# EAGLE design led_clusters (EAGLE 5.10)
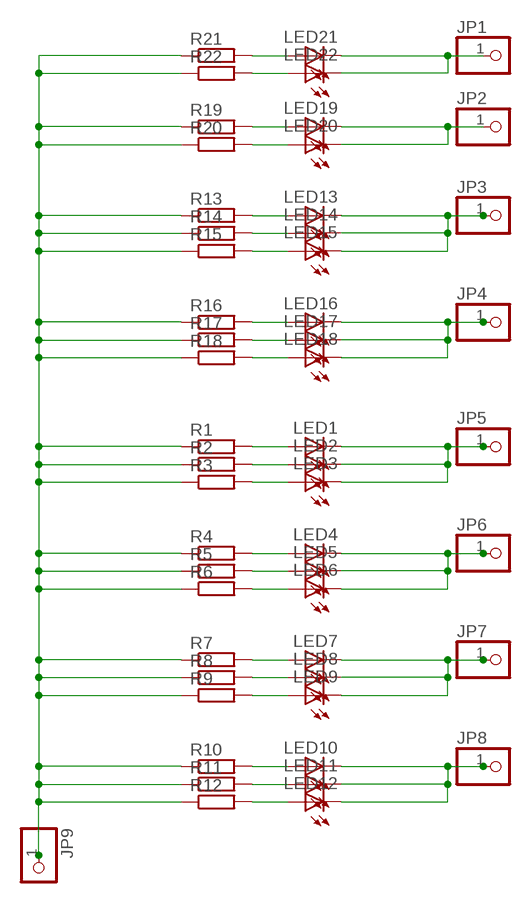
[diagram p0: schematic, sheet 1]

## Parts
JP1  PINHD-1X1  [1X01]
JP2  PINHD-1X1  [1X01]
JP3  PINHD-1X1  [1X01]
JP4  PINHD-1X1  [1X01]
JP5  PINHD-1X1  [1X01]
JP6  PINHD-1X1  [1X01]
JP7  PINHD-1X1  [1X01]
JP8  PINHD-1X1  [1X01]
JP9  PINHD-1X1  [1X01]
LED1  LEDCHIP-LED0805  [CHIP-LED0805]
LED2  LEDCHIP-LED0805  [CHIP-LED0805]
LED3  LEDCHIP-LED0805  [CHIP-LED0805]
LED4  LEDCHIP-LED0805  [CHIP-LED0805]
LED5  LEDCHIP-LED0805  [CHIP-LED0805]
LED6  LEDCHIP-LED0805  [CHIP-LED0805]
LED7  LEDCHIP-LED0805  [CHIP-LED0805]
LED8  LEDCHIP-LED0805  [CHIP-LED0805]
LED9  LEDCHIP-LED0805  [CHIP-LED0805]
LED10  LEDCHIP-LED0805  [CHIP-LED0805]
LED11  LEDCHIP-LED0805  [CHIP-LED0805]
LED12  LEDCHIP-LED0805  [CHIP-LED0805]
LED13  LEDCHIP-LED0805  [CHIP-LED0805]
LED14  LEDCHIP-LED0805  [CHIP-LED0805]
LED15  LEDCHIP-LED0805  [CHIP-LED0805]
LED16  LEDCHIP-LED0805  [CHIP-LED0805]
LED17  LEDCHIP-LED0805  [CHIP-LED0805]
LED18  LEDCHIP-LED0805  [CHIP-LED0805]
LED19  LEDCHIP-LED0805  [CHIP-LED0805]
LED20  LEDCHIP-LED0805  [CHIP-LED0805]
LED21  LEDCHIP-LED0805  [CHIP-LED0805]
LED22  LEDCHIP-LED0805  [CHIP-LED0805]
R1  R-EU_R0805  [R0805]
R2  R-EU_R0805  [R0805]
R3  R-EU_R0805  [R0805]
R4  R-EU_R0805  [R0805]
R5  R-EU_R0805  [R0805]
R6  R-EU_R0805  [R0805]
R7  R-EU_R0805  [R0805]
R8  R-EU_R0805  [R0805]
R9  R-EU_R0805  [R0805]
R10  R-EU_R0805  [R0805]
R11  R-EU_R0805  [R0805]
R12  R-EU_R0805  [R0805]
R13  R-EU_R0805  [R0805]
R14  R-EU_R0805  [R0805]
R15  R-EU_R0805  [R0805]
R16  R-EU_R0805  [R0805]
R17  R-EU_R0805  [R0805]
R18  R-EU_R0805  [R0805]
R19  R-EU_R0805  [R0805]
R20  R-EU_R0805  [R0805]
R21  R-EU_R0805  [R0805]
R22  R-EU_R0805  [R0805]

## Nets
N$1: LED1.A R1.2
N$2: LED2.A R2.2
N$3: LED3.A R3.2
N$4: JP5.1 LED1.C LED2.C LED3.C
N$6: LED4.A R4.2
N$7: LED5.A R5.2
N$8: LED6.A R6.2
N$9: JP6.1 LED4.C LED5.C LED6.C
N$11: LED7.A R7.2
N$12: LED8.A R8.2
N$13: LED9.A R9.2
N$14: JP7.1 LED7.C LED8.C LED9.C
N$16: LED10.A R10.2
N$17: LED11.A R11.2
N$18: LED12.A R12.2
N$19: JP8.1 LED10.C LED11.C LED12.C
N$21: LED13.A R13.2
N$22: LED14.A R14.2
N$23: LED15.A R15.2
N$24: JP3.1 LED13.C LED14.C LED15.C
N$26: LED16.A R16.2
N$27: LED17.A R17.2
N$28: LED18.A R18.2
N$29: JP4.1 LED16.C LED17.C LED18.C
N$31: LED19.A R19.2
N$32: LED20.A R20.2
N$33: LED21.A R21.2
N$34: JP2.1 LED19.C LED20.C
N$36: LED22.A R22.2
N$37: JP1.1 LED21.C LED22.C
VCC: JP9.1 R1.1 R2.1 R3.1 R4.1 R5.1 R6.1 R7.1 R8.1 R9.1 R10.1 R11.1 R12.1 R13.1 R14.1 R15.1 R16.1 R17.1 R18.1 R19.1 R20.1 R21.1 R22.1

## Library data of the parts
JP1-JP9 = adafruit:PINHD-1X1: Pin header 1x1 for 0.1" spacing With round pins
LED1-LED22 = led:LED: LED OSRAM: - CHIPLED LG R971, LG N971, LY N971, LG Q971, LY Q971, LO R971, LY R971 LH N974, LH R974 LS Q976, LO Q976, LY Q976 LO Q996 - Hyper CHIPLED LW Q18S LB Q993, LB Q99A, LB R99A - SideLED LS A670, LO A670, LY A670, LG A670, LP A670 LB A673, LV A673, LT A673, LW A673 LH A674 LY A675 LS A676, LA A676, LO A676, LY A676, LW A676 LS A679, LY A679, LG A679 - Hyper Micro SIDELED® LS Y876, LA Y876, LO Y876, LY Y876 LT Y87S - SmartLED LW L88C, LW L88S LB L89C, LB L89S, LG L890 LS L89K, LO L89K, LY L89K LS L896, LA L896, LO L896, LY L896 - TOPLED LS T670, LO T670, LY T670, LG T670, LP T670 LSG T670, LSP T670, LSY T670, LOP T670, LYG T670 LG T671, LOG T671, LSG T671 LB T673, LV T673, LT T673, LW T673 LH T674 LS T676, LA T676, LO T676, LY T676, LB T676, LH T676, LSB T676, LW T676 LB T67C, LV T67C, LT T67C, LS T67K, LO T67K, LY T67K, LW E67C LS E67B, LA E67B, LO E67B, LY E67B, LB E67C, LV E67C, LT E67C LW T67C LS T679, LY T679, LG T679 LS T770, LO T770, LY T770, LG T770, LP T770 LB T773, LV T773, LT T773, LW T773 LH T774 LS E675, LA E675, LY E675, LS T675 LS T776, LA T776, LO T776, LY T776, LB T776 LHGB T686 LT T68C, LB T68C - Hyper Mini TOPLED® LB M676 - Mini TOPLED Santana® LG M470 LS M47K, LO M47K, LY M47K Source: http://www.osram.convergy.de LUXEON: - LUMILED® LXK2-PW12-R00, LXK2-PW12-S00, LXK2-PW14-U00, LXK2-PW14-V00 LXK2-PM12-R00, LXK2-PM12-S00, LXK2-PM14-U00 LXK2-PE12-Q00, LXK2-PE12-R00, LXK2-PE12-S00, LXK2-PE14-T00, LXK2-PE14-U00 LXK2-PB12-K00, LXK2-PB12-L00, LXK2-PB12-M00, LXK2-PB14-N00, LXK2-PB14-P00, LXK2-PB14-Q00 LXK2-PR12-L00, LXK2-PR12-M00, LXK2-PR14-Q00, LXK2-PR14-R00 LXK2-PD12-Q00, LXK2-PD12-R00, LXK2-PD12-S00 LXK2-PH12-R00, LXK2-PH12-S00 LXK2-PL12-P00, LXK2-PL12-Q00, LXK2-PL12-R00 Source: www.luxeon.com KINGBRIGHT: KA-3528ASYC Source: www.kingbright.com
R1-R22 = rcl:R-EU_: RESISTOR, European symbol

## Board
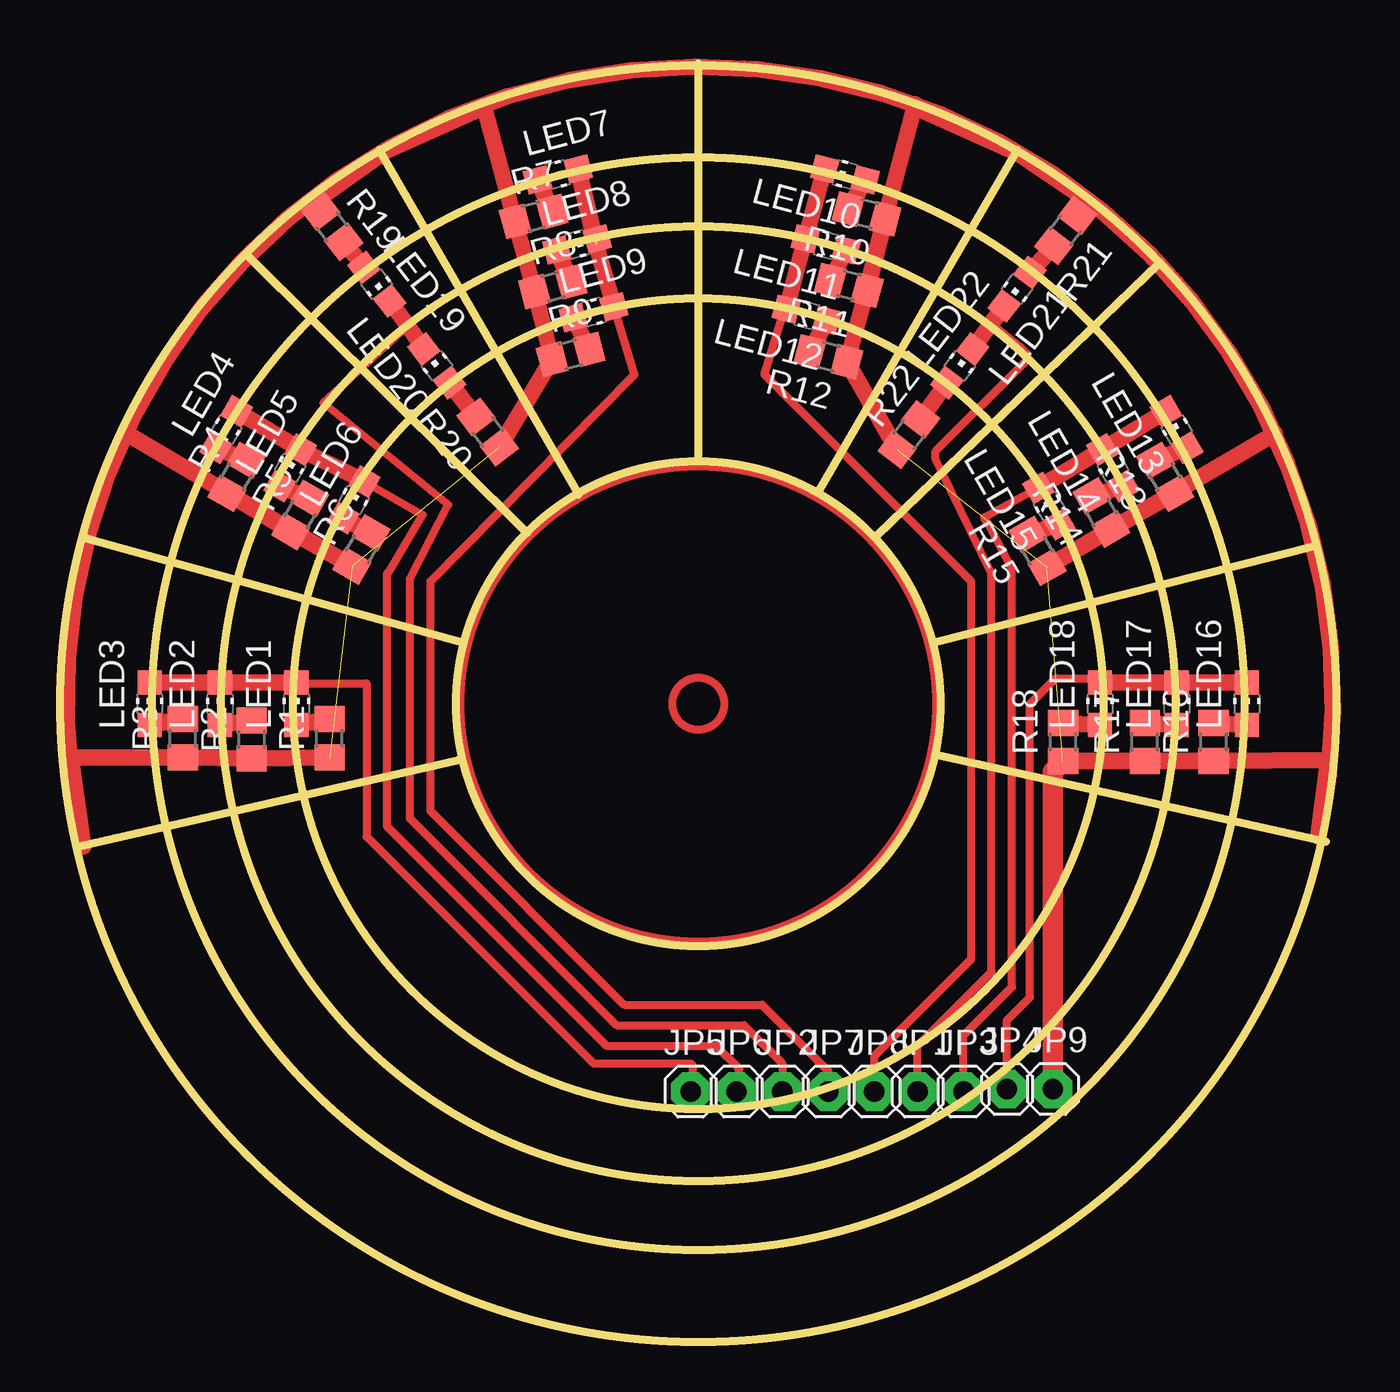
[diagram p1: board, top side]
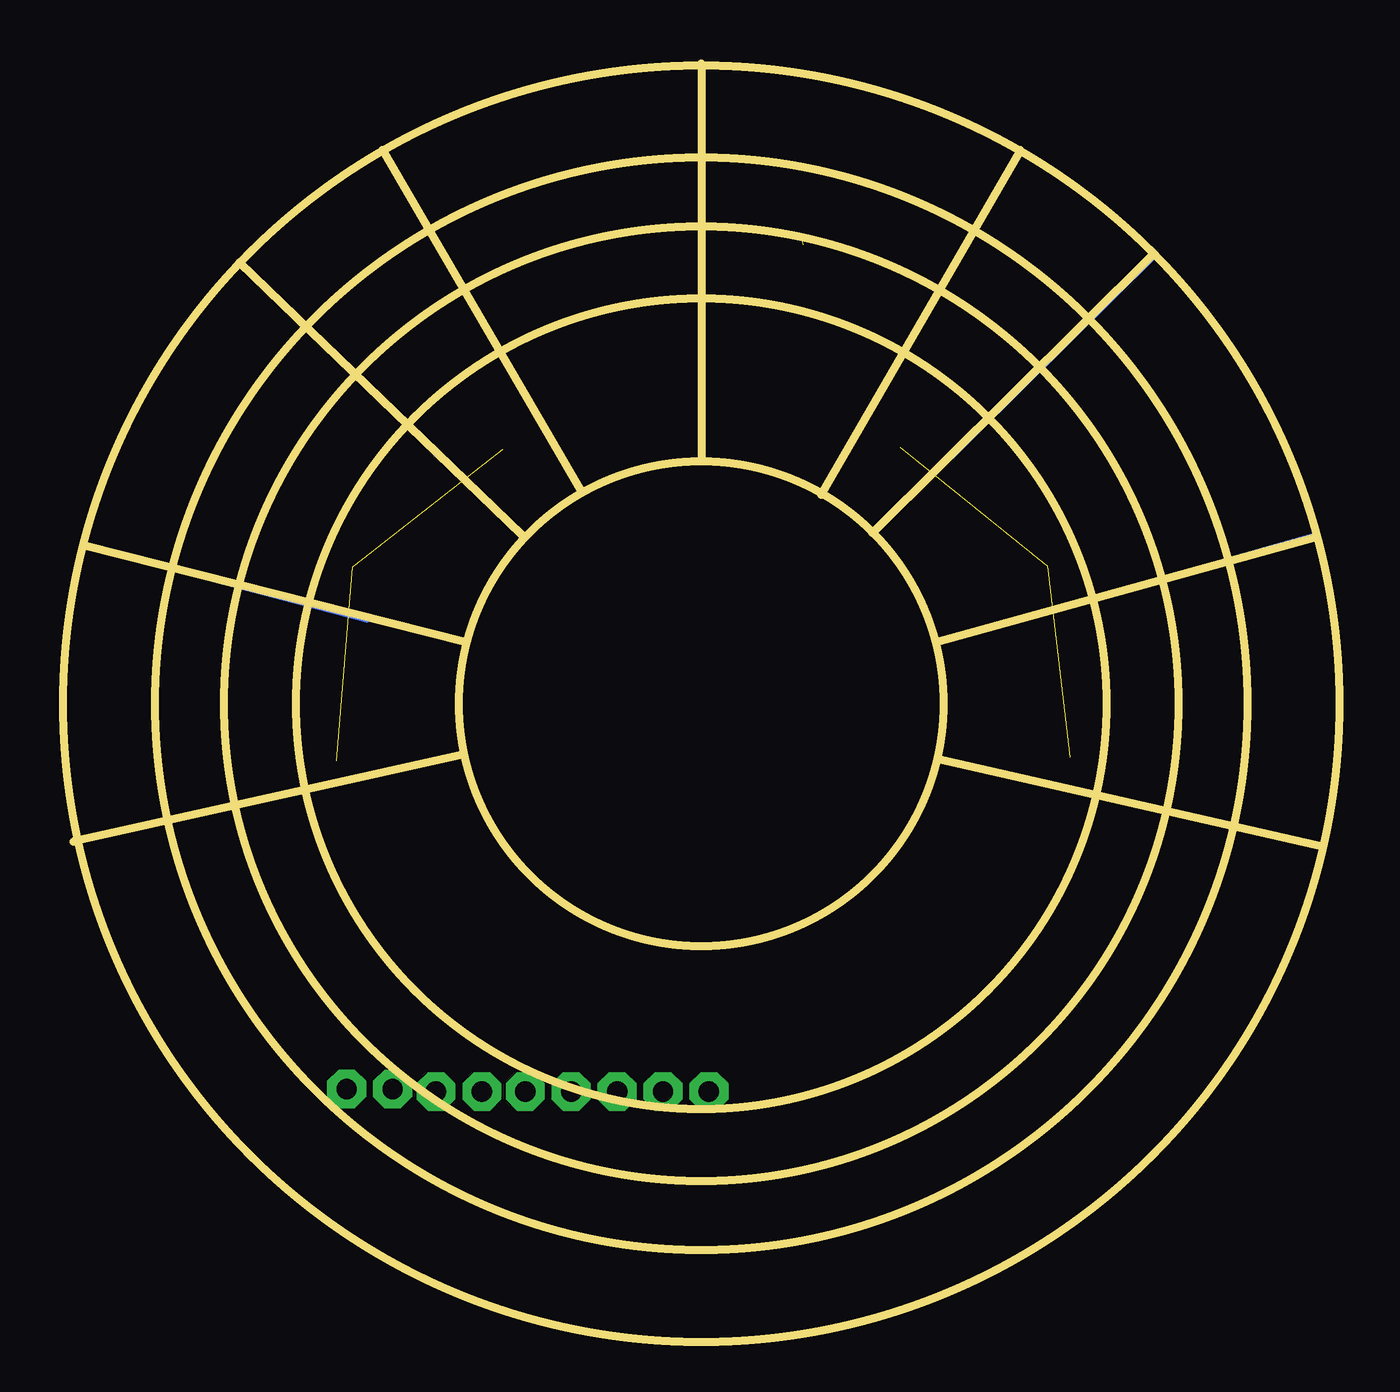
[diagram p2: board, bottom side, seen from below]

Size 63.5 x 63.63 mm. Coordinates in mm from the lower left corner, seen from the top.
Outline: 0.89,24.64 19.81,28.96
Outline: 1.27,40 20.07,34.8
Outline: 9.27,54.1 23.24,40.26
Outline: 15.88,59.31 25.78,42.16
Outline: 31.75,63.63 31.75,43.94
Outline: 47.62,59.31 37.72,42.29
Outline: 40.64,40.13 54.74,53.72
Outline: 43.43,34.8 62.48,39.62
Outline: 43.69,29.21 62.99,24.89
Outline: circle at 31.75,31.75 radius 31.75
Outline: circle at 31.75,31.75 radius 12.05
Outline: circle at 31.75,31.75 radius 27.17
Outline: circle at 31.75,31.75 radius 23.75
Outline: circle at 31.75,31.75 radius 20.17
Copper layers (1*16): Top 0.035mm / dielectric 1.5mm / Bottom 0.035mm
Design rules "default": minimum track width 10mil, minimum drill 24mil, track to track 8mil, track to pad 8mil, pad to pad 8mil, via to via 8mil, smd to smd 8mil, copper to edge 40mil, drill to drill 8mil, minimum pad ring 10mil, minimum via ring 8mil, stop-mask expansion 4mil, vias tented up to drill 0mil, thermal gap 10mil

### Footprints (pad centres in the part's own frame; a part is rotated, then mirrored left to right if it is on the bottom)
1X01 = drill 1.016 pad 1.93 octagon: 1 0,0
CHIP-LED0805 = smd 1.2 x 1.2: A 0,-1.05; C 0,1.05
R0805 = smd 1.3 x 1.5: 1 -0.95,0; 2 0.95,0

### Placement (x,y rotation side)
JP1  42.67,12.45 0 top
JP2  35.94,12.45 0 top
JP3  44.96,12.45 0 top
JP4  47.12,12.57 0 top
JP5  31.37,12.45 0 top
JP6  33.66,12.45 0 top
JP7  38.23,12.45 0 top
JP8  40.51,12.45 0 top
JP9  49.4,12.57 0 top
LED1  11.75,31.75 0 top
LED2  7.94,31.75 0 top
LED3  4.45,31.75 0 top
LED4  8.26,45.4 330 top
LED5  11.43,43.5 330 top
LED6  14.61,41.91 330 top
LED7  24.77,58.1 285 top
LED8  25.72,54.61 285 top
LED9  26.54,51.24 285 top
LED10  39.05,58.1 75 top
LED11  38.1,54.61 75 top
LED12  37.15,51.12 75 top
LED13  55.56,45.4 30 top
LED14  52.39,43.5 30 top
LED15  49.21,41.59 30 top
LED16  59.05,31.75 0 top
LED17  55.56,31.75 0 top
LED18  51.75,31.75 0 top
LED19  15.75,52.64 217.5 top
LED20  18.73,48.58 37.5 top
LED21  47.62,52.39 142.5 top
LED22  44.77,48.58 322.5 top
R1  13.4,30.04 90 top
R2  9.53,29.97 90 top
R3  6.1,30.04 90 top
R4  8.76,43.05 60 top
R5  11.94,41.15 60 top
R6  14.99,39.43 60 top
R7  23.56,56.01 15 top
R8  24.51,52.51 15 top
R9  25.4,49.15 15 top
R10  40.13,56.13 165 top
R11  39.24,52.58 165 top
R12  38.23,49.02 165 top
R13  54.99,43.05 120 top
R14  51.82,41.28 120 top
R15  48.64,39.37 120 top
R16  57.4,29.84 90 top
R17  53.98,29.84 90 top
R18  49.91,29.84 90 top
R19  13.53,55.5 307.5 top
R20  21.27,45.28 127.5 top
R21  50.04,55.31 232.5 top
R22  42.23,45.15 52.5 top

### Tracks (layer width: path | path; a pad name or v marks a point on that pad's centre or on a via)
N$1
  Top 0.813: LED1.A R1.2
N$2
  Top 0.813: LED2.A R2.2
N$3
  Top 0.813: LED3.A R3.2
N$4
  Top 0.406: 11.18,32.8 11.21,32.77 15.24,32.77 15.24,25.15 26.54,13.84 31.37,13.84 31.5,13.72 JP5.1
  Top 0.813: LED3.C LED2.C 11.18,32.8 LED1.C
N$5
  Bottom 0.305: 0.89,24.64 14.1,27.69
N$6
  Top 0.813: R4.2 LED4.A
N$7
  Top 0.813: LED5.A R5.2
N$8
  Top 0.813: LED6.A R6.2
N$9
  Top 0.406: JP6.1 33.78,13.59 32.64,14.73 27.18,14.73 16.26,25.65 16.26,38.23 16.38,38.35 18.03,41.15 14.67,43.05
  Top 0.813: LED4.C LED5.C 14.67,43.05 LED6.C
N$10
  Bottom 0.305: 1.14,40.13 14.99,36.19
N$11
  Top 0.813: R7.2 LED7.A
N$12
  Top 0.813: LED8.A R8.2
N$13
  Top 0.813: R9.2 LED9.A
N$14  (1 unrouted)
  Top 0.406: JP7.1 38.23,13.46 34.93,16.76 28.07,16.76 18.41,26.42 18.41,37.85 28.57,48.13 LED9.C
  Top 0.813: LED7.C 26.67,54.61 LED9.C
N$15
  Bottom 0.305: 9.14,54.1 20.45,42.93
N$16
  Top 0.813: R10.2 LED10.A
N$17
  Top 0.813: LED11.A R11.2
N$18
  Top 0.813: R12.2 LED12.A
N$19
  Top 0.406: JP8.1 40.51,14.22 45.34,19.05 45.34,37.85 35.05,48.13 36.68,53.38
  Top 0.813: LED11.C LED10.C 36.68,53.38 LED12.C
N$20
  Bottom 0.305: 15.88,59.18 21.72,49.28
N$21
  Top 0.813: R13.2 LED13.A
N$22
  Top 0.813: LED14.A R14.2
N$23
  Top 0.813: R15.2 LED15.A
N$24
  Top 0.406: LED15.C 45.97,41.02 46.23,40.64 47.37,38.48 47.37,17.65 44.96,15.24 JP3.1
  Top 0.813: LED15.C LED14.C LED13.C
N$25
  Bottom 0.305: 31.75,63.37 31.75,44.45
N$26
  Top 0.813: R16.2 LED16.A
N$27
  Top 0.813: LED17.A R17.2
N$28
  Top 0.813: R18.2 LED18.A
N$29
  Top 0.406: JP4.1 47.12,16 48.26,17.14 48.26,31.75 49.53,33.02 51.53,33.02 LED18.C
  Top 0.813: LED18.C LED17.C LED16.C
N$30
  Bottom 0.305: 47.62,59.31 41.91,49.53
N$31
  Top 0.813: LED19.A R19.2
N$32
  Top 0.813: LED20.A R20.2
N$33
  Top 0.813: LED21.A R21.2
N$34
  Top 0.406: JP2.1 35.94,13.84 34.04,15.75 27.69,15.75 17.4,26.04 17.4,37.97 19.3,41.66 13.08,46.74 17.27,50.56
  Top 0.813: LED20.C 17.27,50.56 LED19.C
N$35
  Bottom 0.305: 54.61,53.59 44.96,44.2
N$36
  Top 0.813: R22.2 LED22.A
N$37
  Top 0.406: JP1.1 42.67,14.73 46.36,18.41 46.36,38.23 43.81,43.43 43.56,43.94 43.56,44.32 48.13,48.89 48.13,49.15 47.75,49.53 46.36,50.7
  Top 0.813: LED22.C 46.36,50.7 LED21.C
N$38
  Bottom 0.305: 62.36,39.62 48.39,35.94
N$39
  Bottom 0.305: 62.48,25.02 51.44,27.43
VCC  (4 unrouted)
  Top 0.813: R13.1 R14.1 R15.1 60.45,45.21 | R18.1 R17.1 R16.1 63.12,28.96 62.61,25.15 arc206 1.14,24.64 0.51,29.08 R3.1 R2.1 R1.1 | R4.1 R5.1 R6.1 | R6.1 8.26,42.29 | R6.1 3.3,45.21 3.18,45.08 | 42.52,61.48 R10.1 R11.1 R12.1 R22.1 | 42.52,61.48 42.55,61.59 | R21.1 51.18,56.77 47.62,59.18 42.52,61.48 | R19.1 12.7,56.77 16.26,59.31 21.08,61.47 R7.1 R8.1 R9.1 R20.1
  Top 1.016: JP9.1 49.4,28.39 R18.1
(copper drawn outside any net)
  shapes: Top circle x2